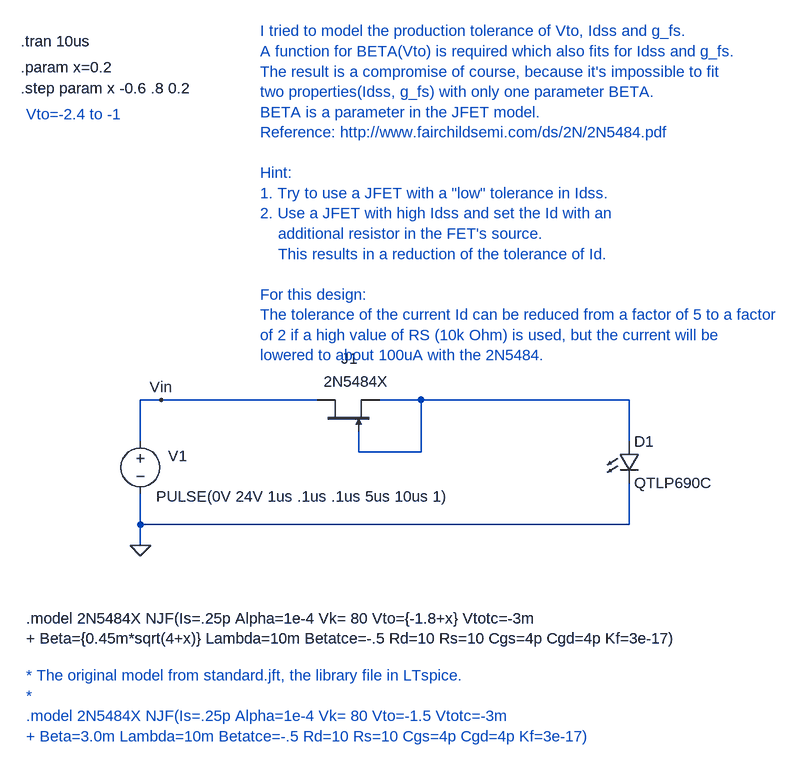
[diagram p0: schematic jfet_input1.asc]
jfet_input1.asc, the LTspice schematic file:
Version 4
SHEET 1 880 680
WIRE -304 64 -304 0
WIRE -304 192 -304 144
WIRE -304 224 -304 192
WIRE -272 0 -304 0
WIRE -32 0 -272 0
WIRE 32 80 32 48
WIRE 128 0 64 0
WIRE 128 80 32 80
WIRE 128 80 128 0
WIRE 448 0 128 0
WIRE 448 64 448 0
WIRE 448 192 -304 192
WIRE 448 192 448 128
FLAG -304 224 0
FLAG -272 0 Vin
SYMBOL voltage -304 48 R0
WINDOW 0 43 38 Left 0
WINDOW 123 -148 152 Left 0
WINDOW 39 -148 68 Left 0
WINDOW 3 24 101 Left 0
SYMATTR InstName V1
SYMATTR Value PULSE(0V 24V 1us .1us .1us 5us 10us 1)
SYMBOL njf -32 48 R270
WINDOW 0 112 37 VRight 0
WINDOW 3 76 10 VRight 0
SYMATTR InstName J1
SYMATTR Value 2N5484X
SYMBOL LED 432 64 R0
SYMATTR InstName D1
SYMATTR Value QTLP690C
TEXT -488 -552 Left 0 !.tran 10us
TEXT -480 336 Left 0 !.model 2N5484X NJF(Is=.25p Alpha=1e-4 Vk= 80 Vto={-1.8+x} Vtotc=-3m\n+ Beta={0.45m*sqrt(4+x)} Lambda=10m Betatce=-.5 Rd=10 Rs=10 Cgs=4p Cgd=4p Kf=3e-17)
TEXT -488 -480 Left 0 !.step param x -0.6 .8 0.2
TEXT -120 -568 Left 0 ;I tried to model the production tolerance of Vto, Idss and g_fs.\nA function for BETA(Vto) is required which also fits for Idss and g_fs.\nThe result is a compromise of course, because it's impossible to fit\ntwo properties(Idss, g_fs) with only one parameter BETA.\nBETA is a parameter in the JFET model.\nReference: http://www.fairchildsemi.com/ds/2N/2N5484.pdf\n \nHint: \n1. Try to use a JFET with a "low" tolerance in Idss.\n2. Use a JFET with high Idss and set the Id with an\n    additional resistor in the FET's source.\n    This results in a reduction of the tolerance of Id.\n \nFor this design:\nThe tolerance of the current Id can be reduced from a factor of 5 to a factor \nof 2 if a high value of RS (10k Ohm) is used, but the current will be \nlowered to about 100uA with the 2N5484.
TEXT -480 -440 Left 0 ;Vto=-2.4 to -1
TEXT -488 -512 Left 0 !.param x=0.2
TEXT -480 424 Left 0 ;* The original model from standard.jft, the library file in LTspice.\n*\n.model 2N5484X NJF(Is=.25p Alpha=1e-4 Vk= 80 Vto=-1.5 Vtotc=-3m\n+ Beta=3.0m Lambda=10m Betatce=-.5 Rd=10 Rs=10 Cgs=4p Cgd=4p Kf=3e-17)

The netlist it stands for:
* jfet_input1.asc
V1 Vin 0 PULSE(0V 24V 1us .1us .1us 5us 10us 1)
J1 Vin N001 N001 2N5484X
D1 N001 0 QTLP690C
.model D D
.lib standard.dio
.model NJF NJF
.model PJF PJF
.lib standard.jft
.tran 10us
.model 2N5484X NJF(Is=.25p Alpha=1e-4 Vk= 80 Vto={-1.8+x} Vtotc=-3m
+ Beta={0.45m*sqrt(4+x)} Lambda=10m Betatce=-.5 Rd=10 Rs=10 Cgs=4p Cgd=4p Kf=3e-17)
.step param x -0.6 .8 0.2
* I tried to model the production tolerance of Vto, Idss and g_fs.
* A function for BETA(Vto) is required which also fits for Idss and g_fs.
* The result is a compromise of course, because it's impossible to fit
* two properties(Idss, g_fs) with only one parameter BETA.
* BETA is a parameter in the JFET model.
* Reference: http://www.fairchildsemi.com/ds/2N/2N5484.pdf
* Hint:
* 1. Try to use a JFET with a "low" tolerance in Idss.
* 2. Use a JFET with high Idss and set the Id with an
*     additional resistor in the FET's source.
*     This results in a reduction of the tolerance of Id.
* For this design:
* The tolerance of the current Id can be reduced from a factor of 5 to a factor
* of 2 if a high value of RS (10k Ohm) is used, but the current will be
* lowered to about 100uA with the 2N5484.
* Vto=-2.4 to -1
.param x=0.2
* * The original model from standard.jft, the library file in LTspice.
* *
* .model 2N5484X NJF(Is=.25p Alpha=1e-4 Vk= 80 Vto=-1.5 Vtotc=-3m
* + Beta=3.0m Lambda=10m Betatce=-.5 Rd=10 Rs=10 Cgs=4p Cgd=4p Kf=3e-17)
.backanno
.end